# Altium project balenaFin HAT Template.PrjPCB
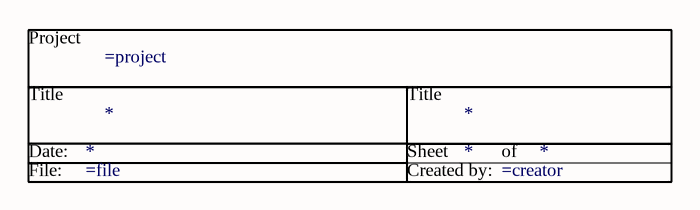
[diagram p0: 1- balenaFin HAT Cover.SchDoc]
2 sheets, 4 parts. Net scope: global (net labels, ports and power ports of the same name join across sheets).
Board file: balenaFin HAT Template PCB.PcbDoc
Sheets:
  1- balenaFin HAT Cover.SchDoc
  3- balenaFin HAT MECH.SchDoc

## Sheet 1- balenaFin HAT Cover.SchDoc
size A

### Parts
(Parts that share a designator on the sheet are numbered #1, #2 ... from top to bottom, then left to right.)
*#1  Title_Block  (value not drawn)  (graphical)

### Notes on the sheet
- (in symbol Title_Block) Project; Title; Date:; Sheet; of; File:; Created by:

## Sheet 3- balenaFin HAT MECH.SchDoc
size A
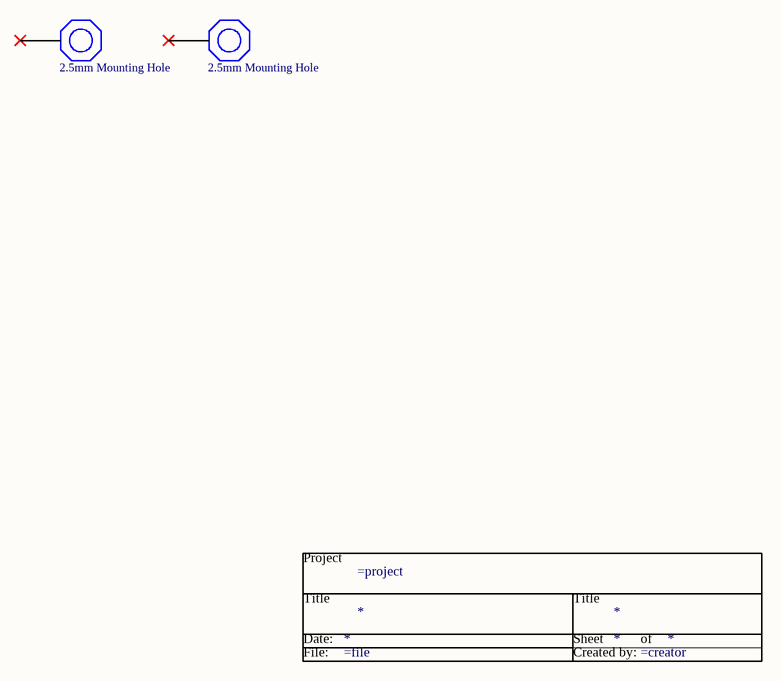
[diagram p1: 3- balenaFin HAT MECH.SchDoc]

### Parts
(Parts that share a designator on the sheet are numbered #1, #2 ... from top to bottom, then left to right.)
*#2  Title_Block  (value not drawn)  (graphical)
M1  2.5mm Mounting Hole  [2.5mm Mounting Hole]  (no BOM)
M2  2.5mm Mounting Hole  [2.5mm Mounting Hole]  (no BOM)

### Nets

Not connected (* = marked no-connect by the designer): M1 1*; M2 1*

### Notes on the sheet
- (in symbol Title_Block) Project; Title; Date:; Sheet; of; File:; Created by: